# EAGLE design TD_DAC (EAGLE 6.4)
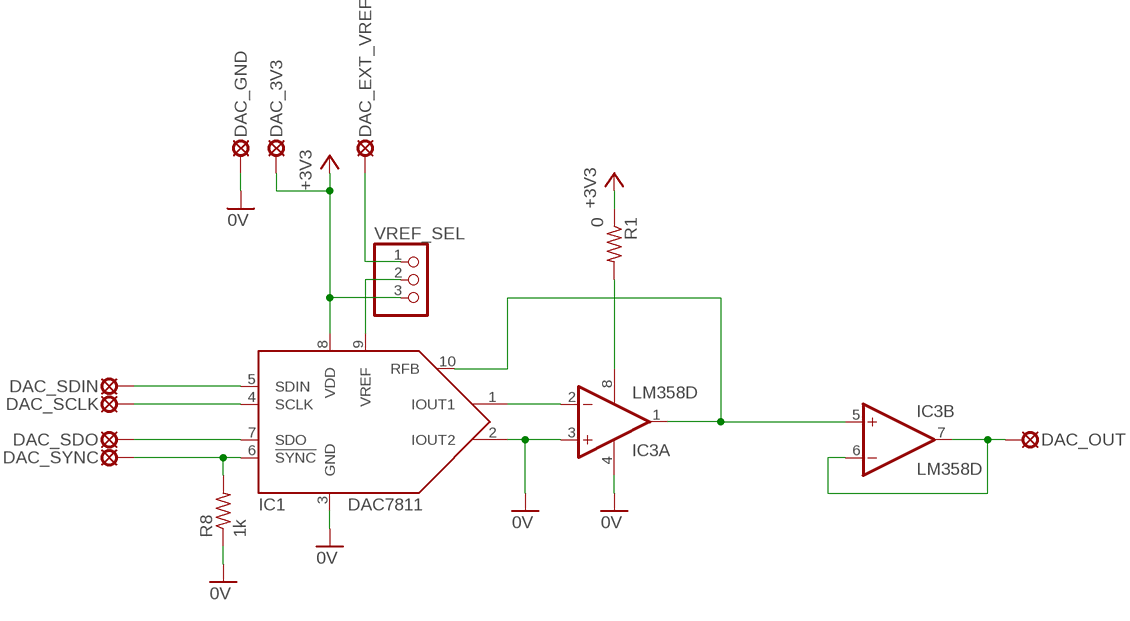
[diagram p0: schematic, sheet 1]

## Parts
DAC_3V3  LSP10  [LSP10]
DAC_EXT_VREF  LSP10  [LSP10]
DAC_GND  LSP10  [LSP10]
DAC_OUT  LSP10  [LSP10]
DAC_SCLK  LSP10  [LSP10]
DAC_SDIN  LSP10  [LSP10]
DAC_SDO  LSP10  [LSP10]
DAC_SYNC  LSP10  [LSP10]
IC1  DAC7811  [S-PDSO-G10]
IC3  LM358D  [SO08]
R1  0  R-US_R1206  [R1206]
R8  1k  R-US_R0805  [R0805]
VREF_SEL  PINHD-1X3  [1X03]

## Nets
0V: DAC_GND.MP IC1.2(IOUT2) IC1.3(GND) IC3.3(A:+IN) IC3.4(P:V-) R8.1
+3V3: DAC_3V3.MP IC1.8(VDD) R1.1 VREF_SEL.3
MCU_SCLK: DAC_SCLK.MP IC1.4(SCLK)
MCU_SDO: DAC_SDIN.MP IC1.5(SDIN)
N$1: IC1.1(IOUT1) IC3.2(A:-IN)
N$2: DAC_OUT.MP IC3.6(B:-IN) IC3.7(B:OUT)
N$3: IC1.9(VREF) VREF_SEL.2
N$4: DAC_EXT_VREF.MP VREF_SEL.1
N$5: DAC_SYNC.MP IC1.6(!SYNC!) R8.2
N$6: IC1.10(RFB) IC3.1(A:OUT) IC3.5(B:+IN)
N$7: IC3.8(P:V+) R1.2
N$9: DAC_SDO.MP IC1.7(SDO)

## Library data of the parts
DAC_3V3 DAC_EXT_VREF DAC_GND DAC_OUT DAC_SCLK DAC_SDIN DAC_SDO DAC_SYNC = solpad:LSP10: SOLDER PAD drill 1.0 mm, distributor Buerklin, 12H555
IC1 = DAC7811:DAC7811
IC3 = linear:LM358: OP AMP also LM158; LM258; LM2904 Source: http://cache.national.com/ds/LM/LM158.pdf
R1 R8 = rcl:R-US_: RESISTOR, American symbol
VREF_SEL = pinhead:PINHD-1X3: PIN HEADER

## Board
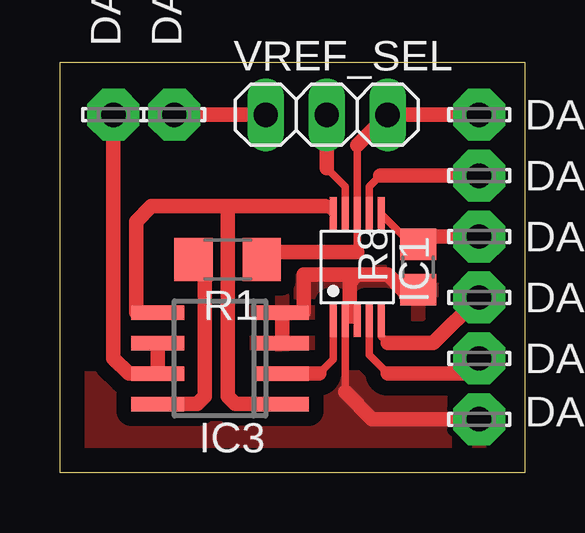
[diagram p1: board, top side]

Size 19.36 x 17.12 mm. Coordinates in mm from the lower left corner, seen from the top.
Outline: 0,0 0,17.12 19.36,17.12 19.36,0 0,0
Copper layers (1*16): Top 0.035mm / dielectric 1.5mm / Bottom 0.035mm
Design rules "default": minimum track width 10mil, minimum drill 24mil, track to track 8mil, track to pad 8mil, pad to pad 8mil, via to via 8mil, smd to smd 8mil, copper to edge 40mil, drill to drill 8mil, minimum pad ring 10mil, minimum via ring 8mil, stop-mask expansion 4mil, vias tented up to drill 0mil, thermal gap 10mil

### Footprints (pad centres in the part's own frame; a part is rotated, then mirrored left to right if it is on the bottom)
LSP10 = drill 1.016 pad 2.159 octagon: MP 0,0
S-PDSO-G10 = smd 0.3 x 1.45: 1 -1,-2.2; 2 -0.5,-2.2; 3 0,-2.2; 4 0.5,-2.2; 5 1,-2.2; 6 1,2.2; 7 0.5,2.2; 8 0,2.2; 9 -0.5,2.2; 10 -1,2.2
SO08 = smd 0.6 x 2.2: 1 -1.905,-2.6; 2 -0.635,-2.6; 3 0.635,-2.6; 4 1.905,-2.6; 5 1.905,2.6; 6 0.635,2.6; 7 -0.635,2.6; 8 -1.905,2.6
R1206 = smd 1.6 x 1.803: 1 -1.422,0; 2 1.422,0
R0805 = smd 1.3 x 1.5: 1 -0.95,0; 2 0.95,0
1X03 = drill 1.016 long: 1 -2.54,0; 2 0,0; 3 2.54,0

### Placement (x,y rotation side)
DAC_3V3  17.46,14.92 0 top
DAC_EXT_VREF  4.76,14.92 0 top
DAC_GND  17.46,2.22 180 top
DAC_OUT  2.22,14.92 180 top
DAC_SCLK  17.46,4.76 0 top
DAC_SDIN  17.46,7.3 0 top
DAC_SDO  17.46,12.38 0 top
DAC_SYNC  17.46,9.84 0 top
IC1  12.38,8.57 0 top
IC3  6.67,4.76 90 top
R1  6.99,8.89 180 top
R8  14.92,8.57 90 top
VREF_SEL  11.11,14.92 0 top

### Tracks (layer width: path | path; a pad name or v marks a point on that pad's centre or on a via)
0V
  Top 0.305: IC1.3 IC1.2 | 11.88,3.36 IC1.2 | R8.1 14.29,7.62 | 12.07,6.55 IC1.2
  Top 0.61: DAC_GND.MP 13.02,2.22 11.88,3.36 | 14.29,7.62 13.65,8.26 12.38,8.26 | 12.38,8.26 12.07,7.94 12.07,6.55 | IC3.3 IC3.4 10.16,6.67 10.16,8.26 12.38,8.26
  pour Top (isolate 0.61): 19.68,0 19.68,17.14 0,17.14 0,0
+3V3
  Top 0.305: R1.1 8.26,8.89 8.26,9.21 | 12.38,9.21 IC1.8 12.38,13.65
  Top 0.61: DAC_3V3.MP VREF_SEL.3 12.38,13.65 | 8.26,9.21 12.38,9.21
MCU_SCLK
  Top 0.305: IC1.4 12.88,4.9 13.65,4.13
  Top 0.61: 13.65,4.13 16.83,4.13 DAC_SCLK.MP
MCU_SDO
  Top 0.305: IC1.5 13.38,5.67 13.65,5.4
  Top 0.61: 13.65,5.4 15.56,5.4 DAC_SDIN.MP
N$1
  Top 0.305: IC1.1 11.38,4.71 10.79,4.13
  Top 0.61: 10.79,4.13 IC3.2
N$2
  Top 0.61: DAC_OUT.MP 2.22,4.76 2.86,4.13 IC3.7 IC3.6
N$3
  Top 0.305: IC1.9 11.88,11.93 11.11,12.7
  Top 0.61: 11.11,12.7 VREF_SEL.2
N$4
  Top 0.61: DAC_EXT_VREF.MP VREF_SEL.1
N$5
  Top 0.305: 15.24,9.84 R8.2 14.63,9.52 IC1.6
  Top 0.61: DAC_SYNC.MP 15.24,9.84
N$6
  Top 0.305: IC3.5 3.17,6.67 | 11.04,11.11 IC1.10
  Top 0.406: 6.99,10.8 7.3,11.11
  Top 0.61: IC3.1 7.3,2.86 6.99,3.18 6.99,10.8 | 3.17,6.67 3.17,10.48 3.81,11.11 7.3,11.11 11.04,11.11
N$7
  Top 0.305: R1.2 6.03,8.42
  Top 0.61: 6.03,8.42 6.03,3.18 5.71,2.86 IC3.8
N$9
  Top 0.305: IC1.7 12.88,11.93 13.34,12.38
  Top 0.61: 13.34,12.38 DAC_SDO.MP